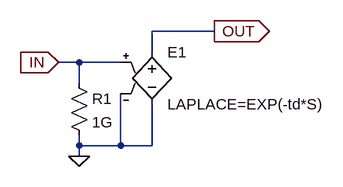
[diagram p0: schematic Delay.asc]
Delay.asc, the LTspice schematic file:
Version 4
SHEET 1 880 680
WIRE 272 -48 176 -48
WIRE 176 -16 176 -48
WIRE 64 0 32 0
WIRE 128 0 64 0
WIRE 64 32 64 0
WIRE 64 128 64 112
WIRE 128 128 128 48
WIRE 128 128 64 128
WIRE 176 128 176 64
WIRE 176 128 128 128
WIRE 64 144 64 128
FLAG 272 -48 OUT
IOPIN 272 -48 Out
FLAG 32 0 IN
IOPIN 32 0 In
FLAG 64 144 0
SYMBOL res 48 16 R0
SYMATTR InstName R1
SYMATTR Value 1G
SYMBOL e 176 -32 R0
SYMATTR InstName E1
SYMATTR Value LAPLACE=EXP(-td*S)

The netlist it stands for:
* Delay.asc
R1 IN 0 1G
E1 OUT 0 IN 0 LAPLACE=EXP(-td*S)
.backanno
.end